# EAGLE design Amplificador (EAGLE 5.11)
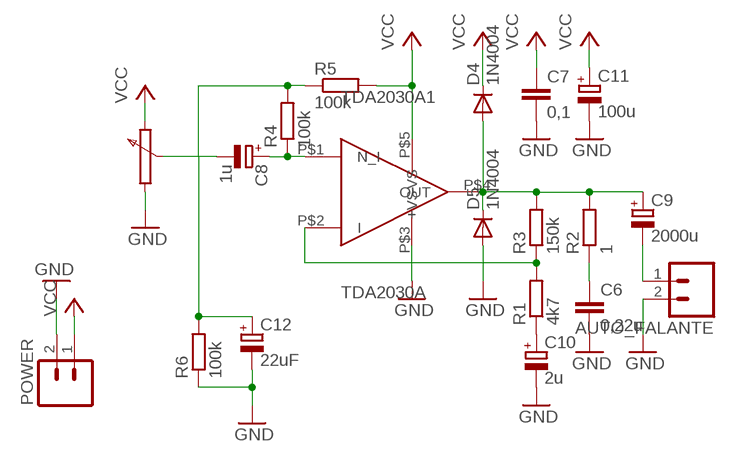
[diagram p0: schematic, sheet 1]

## Parts
AUTO_FALANTE  M02  [02P]
C6  0,22u  C-EU025-024X044  [C025-024X044]
C7  0,1  C-EU025-024X044  [C025-024X044]
C8  1u  CPOL-EUE2,5-6E  [E2,5-6E]
C9  2000u  CPOL-EUE2,5-6E  [E2,5-6E]
C10  2u  CPOL-EUE2,5-6E  [E2,5-6E]
C11  100u  CPOL-EUE2,5-6E  [E2,5-6E]
C12  22uF  CPOL-EUE2,5-6E  [E2,5-6E]
D4  1N4004  [DO41-10]
D5  1N4004  [DO41-10]
POWER  M02  [02P]
R1  4k7  R-EU_0204/7  [0204/7]
R2  1  R-EU_0204/7  [0204/7]
R3  150k  R-EU_0204/7  [0204/7]
R4  100k  R-EU_0204/7  [0204/7]
R5  100k  R-EU_0204/7  [0204/7]
R6  100k  R-EU_0204/7  [0204/7]
TDA2030A1  TDA2030A  [TDA2030A]

## Nets
GND: AUTO_FALANTE.2 C6.2 C7.2 C10.- C11.- C12.- D5.A POWER.2 R6.1 TDA2030A1.P$3(-VS)
N$1: C9.+ D4.A D5.C R2.2 R3.2 TDA2030A1.P$4(OUT)
N$2: C10.+ R1.1
N$4: C8.+ R4.1 TDA2030A1.P$1(N_I)
N$5: R1.2 R3.1 TDA2030A1.P$2(I)
N$6: C6.1 R2.1
N$7: AUTO_FALANTE.1 C9.-
N$10: C8.- C12.+ R4.2 R5.1 R6.2
VCC: C7.1 C11.+ D4.C POWER.1 R5.2 TDA2030A1.P$5(+VS)

## Library data of the parts
AUTO_FALANTE POWER = con-amp-quick:M02: AMP QUICK CONNECTOR
C6 C7 = resistor:C-EU: CAPACITOR, European symbol
C8-C12 = resistor:CPOL-EU: POLARIZED CAPACITOR, European symbol
D4 D5 = diode:1N4004: DIODE general purpose rectifier, 1 A
R1-R6 = rcl:R-EU_: RESISTOR, European symbol
TDA2030A1 = TDA2030:TDA2030A

## Board
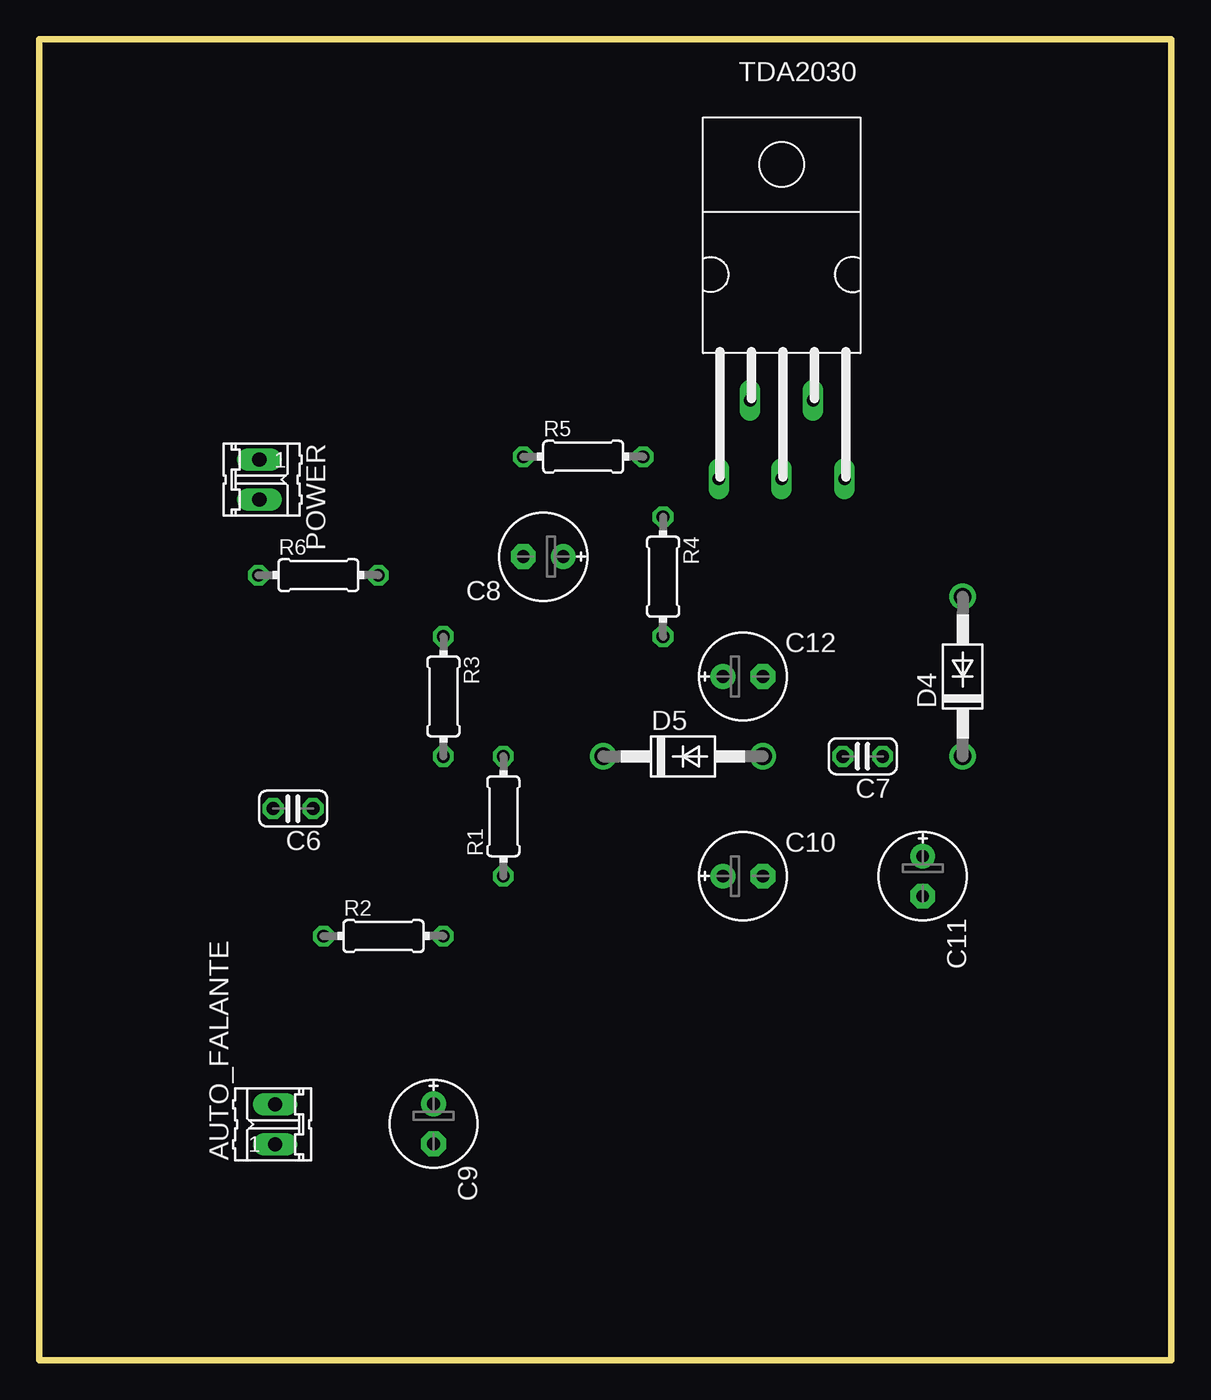
[diagram p1: board, top side]
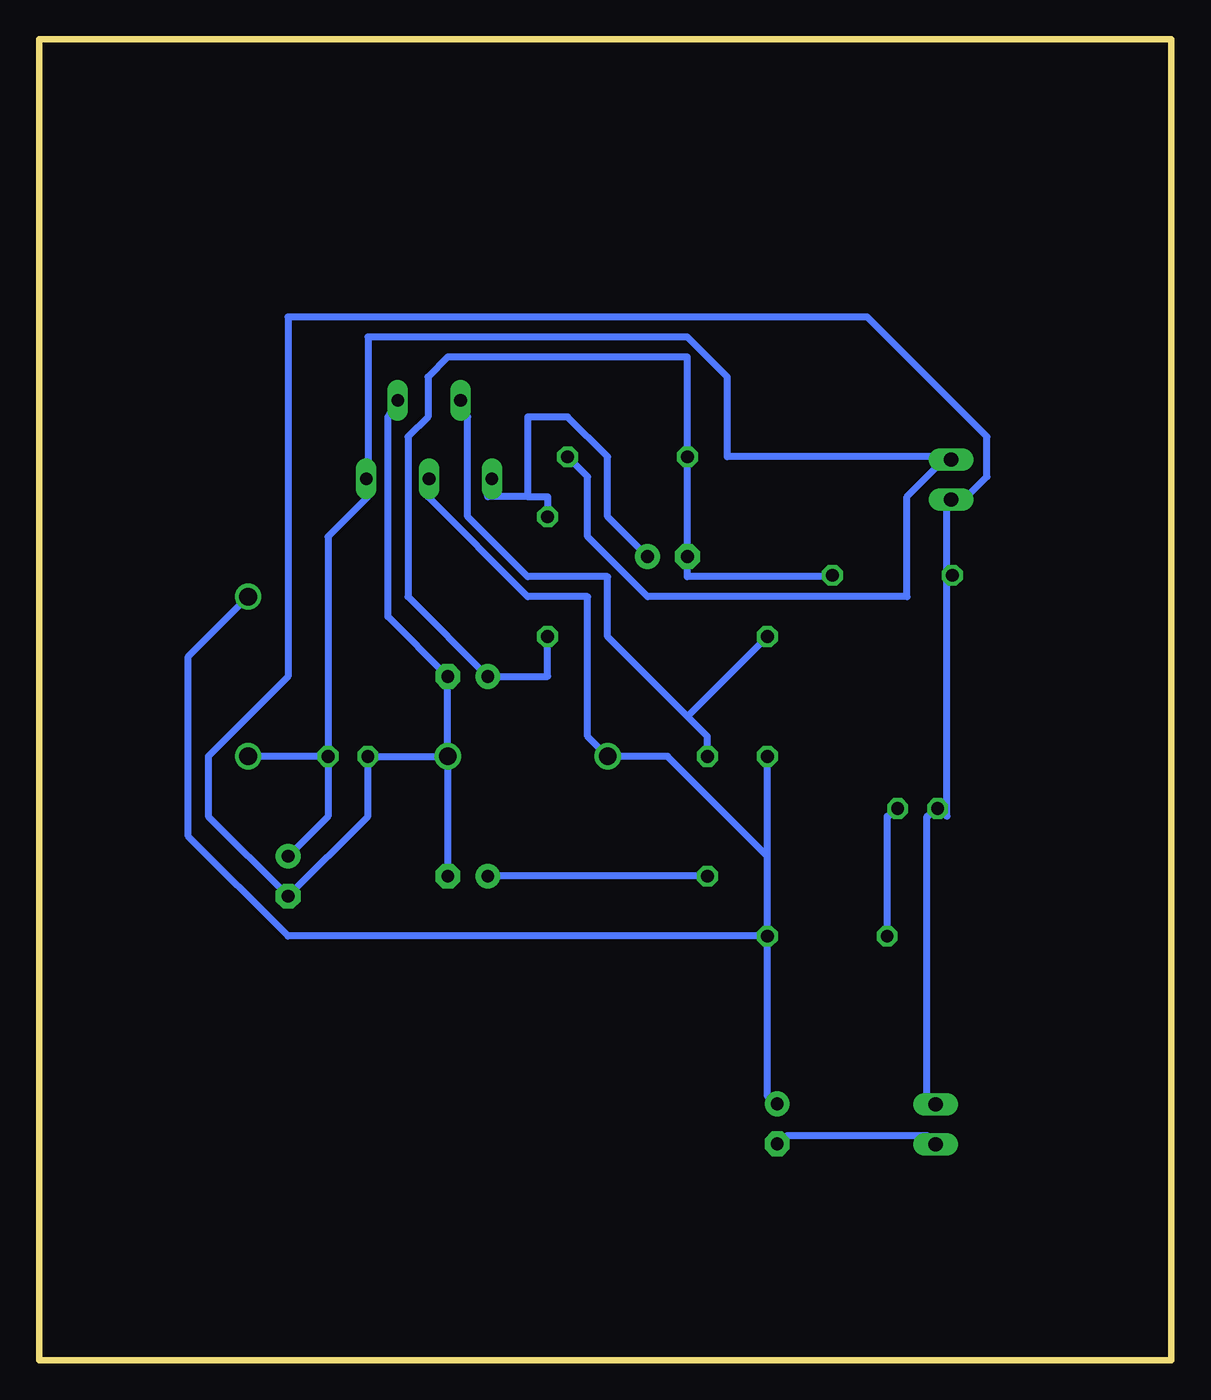
[diagram p2: board, bottom side, seen from below]

Size 72 x 84 mm. Coordinates in mm from the lower left corner, seen from the top.
Outline: 0,84 72,84 72,0 0,0 0,84
Copper layers (1*16): Top 0.035mm / dielectric 1.5mm / Bottom 0.035mm
Design rules "default *": minimum track width 18mil, minimum drill 24mil, track to track 8mil, track to pad 8mil, pad to pad 8mil, via to via 8mil, smd to smd 8mil, copper to edge 40mil, drill to drill 8mil, minimum pad ring 10mil, minimum via ring 8mil, stop-mask expansion 4mil, vias tented up to drill 0mil, thermal gap 10mil

### Footprints (pad centres in the part's own frame; a part is rotated, then mirrored left to right if it is on the bottom)
02P = drill 0.914 long: 1 -1.27,0; 2 1.27,0
C025-024X044 = drill 0.813 octagon: 1 -1.27,0; 2 1.27,0
E2,5-6E = drill 0.813 pad 1.575 round: + -1.27,0 | drill 0.813 pad 1.575 octagon: - 1.27,0
DO41-10 = drill 1.118 round: A 5.08,0; C -5.08,0
0204/7 = drill 0.813 octagon: 1 -3.81,0; 2 3.81,0
TDA2030A = drill 0.8 long: P$1 -4.08,-14.11; P$2 -2.08,-9.11; P$3 1.92,-9.11; P$4 -0.08,-14.11; P$5 3.92,-14.11

### Placement (x,y rotation side)
AUTO_FALANTE  15,15 90 top
C6  16.14,35.08 180 top
C7  52.37,38.4 180 top
C8  32.05,51.1 180 top
C9  25.08,15.03 270 top
C10  44.75,30.78 0 top
C11  56.18,30.78 270 top
C12  44.75,43.48 0 top
D4  58.72,43.48 90 top
D5  40.94,38.4 0 top
POWER  14,56 270 top
R1  29.51,34.59 90 top
R2  21.89,26.97 0 top
R3  25.7,42.21 270 top
R4  39.67,49.83 270 top
R5  34.59,57.45 0 top
R6  17.75,49.92 0 top
TDA2030A1  47.29,70.15 0 top

### Tracks (layer width: path | path; a pad name or v marks a point on that pad's centre or on a via)
GND
  Bottom 0.457: 14.27,49.83 14.27,34.59 C6.2 15.54,34.59 15.54,16.81 AUTO_FALANTE.2 | 14.27,49.83 14.27,54.91 POWER.2 13,54.91 11.73,56.18 11.73,58.72 19.35,66.34 56.18,66.34 56.18,43.48 61.26,38.4 61.26,34.59 C11.- 51.1,34.59 C7.2 D5.A | 14.27,49.83 R6.1 | D5.A C10.- | TDA2030A1.P$3 49.83,59.99 49.83,47.29 C12.- D5.A
N$1
  Bottom 0.457: TDA2030A1.P$4 47.29,54.91 40.94,48.56 37.13,48.56 37.13,39.67 D5.C 32.05,38.4 25.7,32.05 | R2.2 25.7,16.81 C9.+ | R2.2 25.7,32.05 | 25.7,32.05 R3.2 | D4.A 62.53,44.75 62.53,33.32 56.18,26.97 R2.2
N$2
  Bottom 0.457: R1.1 C10.+
N$4
  Bottom 0.457: 40.94,54.91 39.67,54.91 R4.1 | 40.94,54.91 43.48,54.91 TDA2030A1.P$1 | C8.+ 35.86,53.64 35.86,57.45 38.4,59.99 40.94,59.99 40.94,54.91
N$5
  Bottom 0.457: 30.78,40.94 29.51,39.67 R1.2 | 30.78,40.94 35.86,46.02 35.86,49.83 40.94,49.83 44.75,53.64 44.75,59.99 TDA2030A1.P$2 | 30.78,40.94 R3.1
N$6
  Bottom 0.457: R2.1 18.08,34.59 C6.1
N$7
  Bottom 0.457: C9.- 24.43,14.27 15.54,14.27 AUTO_FALANTE.1
N$10
  Bottom 0.457: R4.2 39.67,43.48 C12.+ 48.56,48.56 48.56,58.72 47.29,59.99 47.29,62.53 46.02,63.8 30.78,63.8 R5.1 C8.- 30.78,49.83 21.89,49.83 R6.2
VCC
  Bottom 0.457: R5.2 37.13,56.18 37.13,52.37 33.32,48.56 16.81,48.56 16.81,54.91 14.27,57.45 | C7.1 53.64,52.37 51.1,54.91 TDA2030A1.P$5 51.1,56.18 51.1,65.07 30.78,65.07 28.24,62.53 28.24,57.45 14.27,57.45 | C11.+ 53.64,34.59 C7.1 | C7.1 D4.C | 14.27,57.45 POWER.1